# EAGLE design SG1000 - SMS OD (EAGLE 9.6.2)
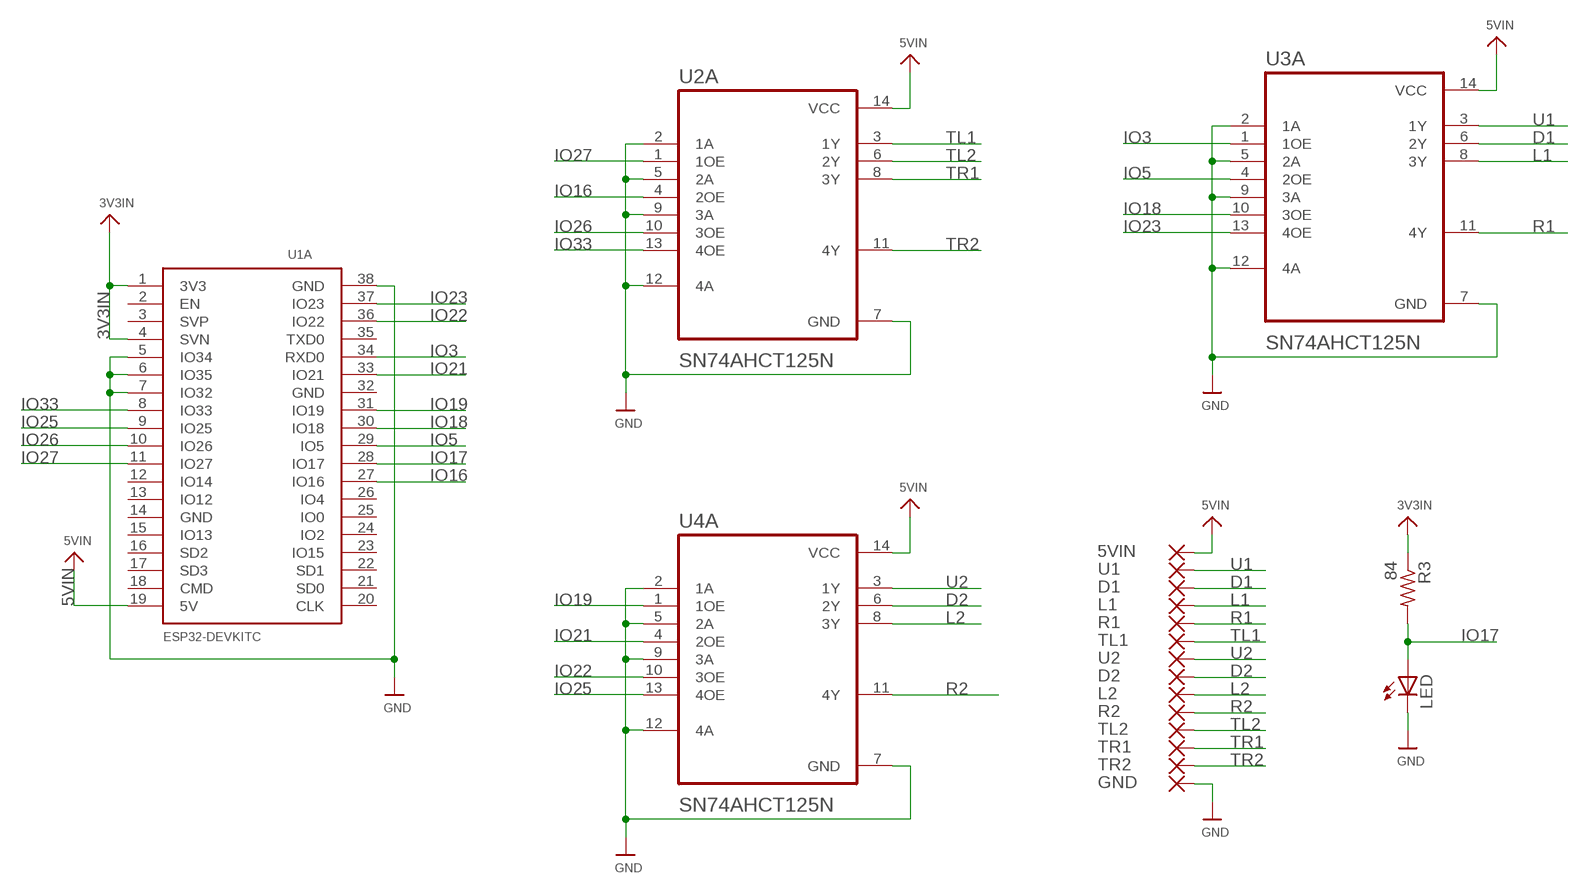
[diagram p0: schematic, sheet 1]

## Parts
5VIN  SMD5  [SMD2,54-5,08]
D1  SMD5  [SMD2,54-5,08]
D2  SMD5  [SMD2,54-5,08]
GND  SMD5  [SMD2,54-5,08]
L1  SMD5  [SMD2,54-5,08]
L2  SMD5  [SMD2,54-5,08]
LED  LEDCHIPLED_1206  [CHIPLED_1206]
R1  SMD5  [SMD2,54-5,08]
R2  SMD5  [SMD2,54-5,08]
R3  84  R-US_R1206  [R1206]
TL1  SMD5  [SMD2,54-5,08]
TL2  SMD5  [SMD2,54-5,08]
TR1  SMD5  [SMD2,54-5,08]
TR2  SMD5  [SMD2,54-5,08]
U1  SMD5  [SMD2,54-5,08]
U1A  ESP32DEVKITC  [ESP32-DEVKITC]
U2  SMD5  [SMD2,54-5,08]
U2A  SN74AHCT125N  [DIP794W45P254L1969H508Q14]
U3A  SN74AHCT125N  [DIP794W45P254L1969H508Q14]
U4A  SN74AHCT125N  [DIP794W45P254L1969H508Q14]

## Nets
3V3IN: R3.1 U1A.1(3V3) U1A.4(SVN)
5VIN: 5VIN.1(P) U1A.19(5V) U2A.14(VCC) U3A.14(VCC) U4A.14(VCC)
D1: D1.1(P) U3A.6(2Y)
D2: D2.1(P) U4A.6(2Y)
GND: GND.1(P) LED.C U1A.5(IO34) U1A.6(IO35) U1A.7(IO32) U1A.38(GND) U2A.2(1A) U2A.5(2A) U2A.7(GND) U2A.9(3A) U2A.12(4A) U3A.2(1A) U3A.5(2A) U3A.7(GND) U3A.9(3A) U3A.12(4A) U4A.2(1A) U4A.5(2A) U4A.7(GND) U4A.9(3A) U4A.12(4A)
IO3: U1A.34(RXD0) U3A.1(1OE)
IO5: U1A.29(IO5) U3A.4(2OE)
IO16: U1A.27(IO16) U2A.4(2OE)
IO17: LED.A R3.2 U1A.28(IO17)
IO18: U1A.30(IO18) U3A.10(3OE)
IO19: U1A.31(IO19) U4A.1(1OE)
IO21: U1A.33(IO21) U4A.4(2OE)
IO22: U1A.36(IO22) U4A.10(3OE)
IO23: U1A.37(IO23) U3A.13(4OE)
IO25: U1A.9(IO25) U4A.13(4OE)
IO26: U1A.10(IO26) U2A.10(3OE)
IO27: U1A.11(IO27) U2A.1(1OE)
IO33: U1A.8(IO33) U2A.13(4OE)
L1: L1.1(P) U3A.8(3Y)
L2: L2.1(P) U4A.8(3Y)
R1: R1.1(P) U3A.11(4Y)
R2: R2.1(P) U4A.11(4Y)
TL1: TL1.1(P) U2A.3(1Y)
TL2: TL2.1(P) U2A.6(2Y)
TR1: TR1.1(P) U2A.8(3Y)
TR2: TR2.1(P) U2A.11(4Y)
U1: U1.1(P) U3A.3(1Y)
U2: U2.1(P) U4A.3(1Y)
Unconnected: U1A.2(EN) U1A.3(SVP) U1A.12(IO14) U1A.13(IO12) U1A.14(GND) U1A.15(IO13) U1A.16(SD2) U1A.17(SD3) U1A.18(CMD) U1A.20(CLK) U1A.21(SD0) U1A.22(SD1) U1A.23(IO15) U1A.24(IO2) U1A.25(IO0) U1A.26(IO4) U1A.32(GND) U1A.35(TXD0)

## Library data of the parts
5VIN D1 D2 GND L1 L2 R1 R2 TL1 TL2 TR1 TR2 U1 U2 = wirepad:SMD5: SMD PAD
LED = adafruit:LED: LED OSRAM: - CHIPLED LG R971, LG N971, LY N971, LG Q971, LY Q971, LO R971, LY R971 LH N974, LH R974 LS Q976, LO Q976, LY Q976 LO Q996 - Hyper CHIPLED LW Q18S LB Q993, LB Q99A, LB R99A - SideLED LS A670, LO A670, LY A670, LG A670, LP A670 LB A673, LV A673, LT A673, LW A673 LH A674 LY A675 LS A676, LA A676, LO A676, LY A676, LW A676 LS A679, LY A679, LG A679 - Hyper Micro SIDELED® LS Y876, LA Y876, LO Y876, LY Y876 LT Y87S - SmartLED LW L88C, LW L88S LB L89C, LB L89S, LG L890 LS L89K, LO L89K, LY L89K LS L896, LA L896, LO L896, LY L896 - TOPLED LS T670, LO T670, LY T670, LG T670, LP T670 LSG T670, LSP T670, LSY T670, LOP T670, LYG T670 LG T671, LOG T671, LSG T671 LB T673, LV T673, LT T673, LW T673 LH T674 LS T676, LA T676, LO T676, LY T676, LB T676, LH T676, LSB T676, LW T676 LB T67C, LV T67C, LT T67C, LS T67K, LO T67K, LY T67K, LW E67C LS E67B, LA E67B, LO E67B, LY E67B, LB E67C, LV E67C, LT E67C LW T67C LS T679, LY T679, LG T679 LS T770, LO T770, LY T770, LG T770, LP T770 LB T773, LV T773, LT T773, LW T773 LH T774 LS E675, LA E675, LY E675, LS T675 LS T776, LA T776, LO T776, LY T776, LB T776 LHGB T686 LT T68C, LB T68C - Hyper Mini TOPLED® LB M676 - Mini TOPLED Santana® LG M470 LS M47K, LO M47K, LY M47K Source: http://www.osram.convergy.de/
R3 = adafruit:R-US_: RESISTOR, American symbol
U1A = ESP32-DEVKITC:ESP32DEVKITC
U2A U3A U4A = SN74AHCT125N:SN74AHCT125N: None Check prices <https://pricing.snapeda.com/parts/SN74AHCT125N/Texas%20Instruments/view-part?ref=eda>; AVAILABILITY: In Stock; DESCRIPTION: Quadruple Bus Buffer Gates With 3-State Outputs 14-PDIP -40 to 125; MF: Texas Instruments; MP: SN74AHCT125N; PACKAGE: PDIP-14 Texas Instruments; PRICE: None; PURCHASE-URL: https://pricing.snapeda.com/search/part/SN74AHCT125N/?ref=eda

## Board
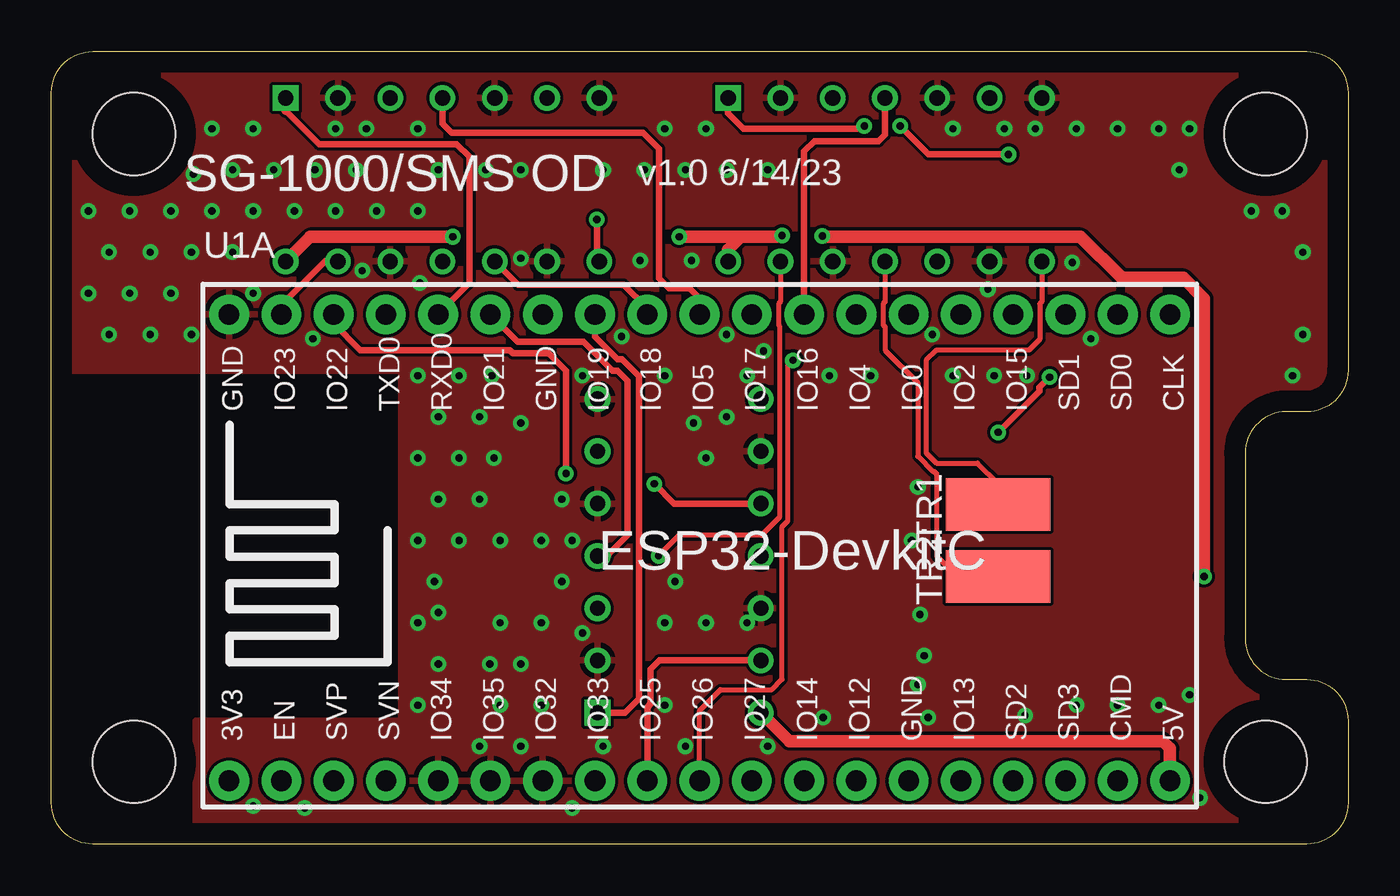
[diagram p1: board, top side]
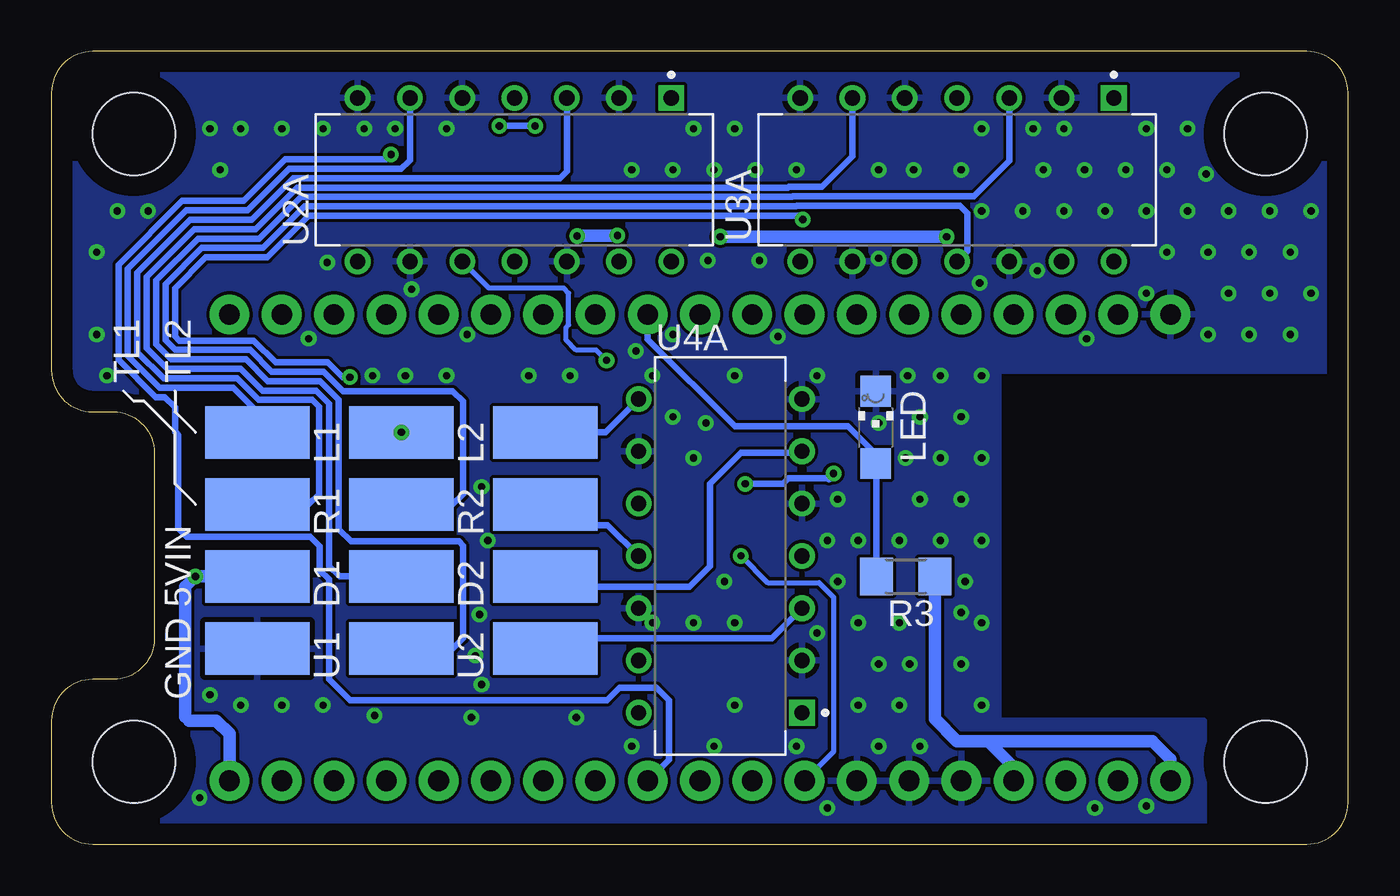
[diagram p2: board, bottom side, seen from below]

Size 63 x 38.5 mm. Coordinates in mm from the lower left corner, seen from the top.
Outline: 0,2 0,36.5 arc-90 2,38.5 61,38.5 arc-90 63,36.5 63,23 arc-90 61,21 60,21 arc90 58,19 58,10 arc90 60,8 61,8 arc-90 63,6 63,2 arc-90 61,0 2,0 arc-90 0,2
Copper layers (1*16): Top 0.035mm / dielectric 1.5mm / Bottom 0.035mm
Design rules "default": minimum track width 6mil, minimum drill 0.35mm, track to track 6mil, track to pad 6mil, pad to pad 6mil, via to via 6mil, smd to smd 6mil, copper to edge 40mil, drill to drill 6mil, minimum pad ring 10mil, minimum via ring 8mil, stop-mask expansion 4mil, vias tented up to drill 0.5mm, thermal gap 10mil
Holes 4 mm at 4,4 4,34.5 59,34.5 59,4

### Footprints (pad centres in the part's own frame; a part is rotated, then mirrored left to right if it is on the bottom)
SMD2,54-5,08 = smd 2.54 x 5.08: 1 0,0
CHIPLED_1206 = smd 1.5 x 1.5: A 0,-1.75; C 0,1.75
R1206 = smd 1.6 x 1.803: 1 -1.422,0; 2 1.422,0
ESP32-DEVKITC = drill 1 pad 1.93: 1 -22.87,-11.42; 2 -20.33,-11.42; 3 -17.79,-11.42; 4 -15.25,-11.42; 5 -12.71,-11.42; 6 -10.17,-11.42; 7 -7.63,-11.42; 8 -5.09,-11.42; 9 -2.55,-11.42; 10 -0.01,-11.42; 11 2.53,-11.42; 12 5.07,-11.42; 13 7.61,-11.42; 14 10.15,-11.42; 15 12.69,-11.42; 16 15.23,-11.42; 17 17.77,-11.42; 18 20.31,-11.42; 19 22.85,-11.42; 20 22.85,11.23; 21 20.31,11.23; 22 17.77,11.23; 23 15.23,11.23; 24 12.69,11.23; 25 10.15,11.23; 26 7.61,11.23; 27 5.07,11.23; 28 2.53,11.23; 29 -0.01,11.23; 30 -2.55,11.23; 31 -5.09,11.23; 32 -7.63,11.23; 33 -10.17,11.23; 34 -12.71,11.23; 35 -15.25,11.23; 36 -17.79,11.23; 37 -20.33,11.23; 38 -22.87,11.23
DIP794W45P254L1969H508Q14 = drill 0.74 pad 1.14 square: 1 -3.97,7.62 | drill 0.74 pad 1.14: 2 -3.97,5.08; 3 -3.97,2.54; 4 -3.97,0; 5 -3.97,-2.54; 6 -3.97,-5.08; 7 -3.97,-7.62; 8 3.97,-7.62; 9 3.97,-5.08; 10 3.97,-2.54; 11 3.97,0; 12 3.97,2.54; 13 3.97,5.08; 14 3.97,7.62

### Placement (x,y rotation side)
5VIN  53,13 270 bottom
D1  46,13 270 bottom
D2  39,13 270 bottom
GND  53,9.5 270 bottom
L1  46,20 270 bottom
L2  39,20 270 bottom
LED  22.95,20.24 0 bottom
R1  46,16.5 270 bottom
R2  39,16.5 270 bottom
R3  21.5,13 180 bottom
TL1  53,16.5 270 bottom
TL2  53,20 90 bottom
TR1  46,16.5 90 top
TR2  46,13 90 top
U1  46,9.5 270 bottom
U1A  31.5,14.5 0 top
U2  39,9.5 270 bottom
U2A  40.5,32.27 270 bottom
U3A  19,32.27 270 bottom
U4A  30.5,14 180 bottom

### Tracks (layer width: path | path; a pad name or v marks a point on that pad's centre or on a via)
3V3IN
  Bottom 0.61: U1A.1 8.63,4.13 9.5,5 17.5,5 | R3.1 20.08,6.08 19,5 17.5,5 | U1A.4 16.25,3.75 17.5,5
5VIN  (via drill 0.35)
  Top 0.61: U1A.19 54.35,4.65 54,5 35.85,5 U4A.14 | v37.46,29.54 37.5,29.5 50,29.5 52,27.5 55,27.5 56,26.5 v56,13 | v35.5,29.57 35.43,29.5 33.5,29.5 | 33.5,29.5 32.88,28.88 U2A.14 | 33.5,29.5 v30.5,29.5 | v19.5,29.5 12.58,29.5 U3A.14
  Bottom 0.61: U1A.19 54.35,5.35 55,6 56.3,6 56.5,6.2 56.5,12.5 v56,13 5VIN.1 | v37.46,29.54 35.52,29.54 v35.5,29.57 | v30.5,29.5 v19.5,29.5
D1
  Bottom 0.305: U3A.6 24.08,33.42 25.57,31.93 27.16,31.93 27.2,31.89 51.07,31.89 53.09,29.87 56.07,29.87 58.37,27.57 58.37,24.09 57.37,23.09 53.8,23.09 52.74,22.03 50.14,22.03 49.5,21.39 49.5,13.5 49,13 D1.1
D2
  Bottom 0.305: 26.61,19 29.5,19 31,17.5 31,13.5 32,12.5 38.5,12.5
  Bottom 0.406: U4A.6 26.61,19 | 38.5,12.5 D2.1
GND  (via drill 0.35)
  other vias: 2.8,24.75 1.8,26.75 2.8,28.75 1.8,30.75 4.8,24.75 3.8,26.75 4.8,28.75 3.8,30.75 6.8,24.75 5.8,26.75 6.8,28.75 5.8,30.75 6.9,32.55 12.3,1.75 8.8,28.75 7.8,30.75 8.8,32.75 7.8,34.75 9.8,1.85 9.8,26.75 9.8,30.75 10.8,32.75 9.8,34.75 18.8,11.25 12.7,24.55 11.8,30.75 12.8,32.75 15.1,27.85 13.8,30.75 14.8,32.75 13.8,34.75 15.8,30.75 15.3,34.75 17.8,6.75 18.8,8.75 17.8,10.75 18.6,12.75 17.8,14.75 18.8,16.75 17.8,18.75 18.8,20.75 17.8,22.75 17.9,27.25 17.8,30.75 18.8,32.75 17.8,34.75 20.8,4.75 21.3,8.75 19.8,14.75 20.8,16.75 19.8,18.75 20.8,20.75 19.8,22.75 21.1,32.75 22.8,4.75 21.8,6.75 22.8,8.75 21.8,10.75 21.8,14.75 21.5,18.75 22.8,20.45 21.4,22.75 22.8,28.45 22.8,32.75 25.3,1.75 23.8,6.75 23.8,10.75 24.8,12.75 23.8,14.75 24.8,16.75 27.7,24.65 26.8,4.75 25.8,10.25 25.3,14.75 25.8,22.75 26.8,32.75 28.6,28.35 28.8,32.75 30.8,4.75 29.8,6.75 29.8,10.75 30.3,12.75 31.2,20.45 29.8,22.75 31.1,28.35 30.8,32.75 29.8,34.75 31.8,10.75 31.8,18.75 32.8,20.75 32.8,24.75 32.8,32.75 31.8,34.75 34.8,4.75 33.8,10.75 33.8,22.75 34.6,23.95 34.8,32.75 37.5,6.15 42.1,7.75 37.8,22.75 42.1,17.35 39.8,22.75 42.4,9.15 42.2,11.15 41.8,14.75 42.8,24.75 43.8,22.75 43.8,34.75 45.8,22.75 45.5,26.95 49.6,28.25 46.3,34.75 47.3,6.25 47.4,22.75 47.8,34.75 49.8,6.75 50.5,24.55 49.8,34.75 51.8,6.75 42.6,6.15 51.8,34.75 53.8,6.75 54.8,32.75 53.8,34.75 55.8,2.25 55.3,7.25 55.3,34.75 58.3,30.75 60.3,22.75 60.8,24.75 60.8,28.75 59.8,30.75
  pour Bottom: 7,0 63,0 63,38.5 0,38.5 0,23 17,23 17,6 7,6
  pour Top: 0,38.5 0,23 17,23 17,6 7,6 7,0 63,0 63,38.5
IO3
  Top 0.305: U1A.34 20.32,27.26 20.32,33.38 19.7,34 13,34 11.38,35.62
  Top 0.406: U3A.1 11.38,35.62
IO5
  Top 0.305: U3A.4 19,35 19.44,34.56 28.73,34.56 29.51,33.78 29.51,27.49 30,27 31,27 31.49,26.51 U1A.29
IO16
  Top 0.305: U2A.4 40.5,34.46 40.19,34.15 37.07,34.15 36.57,33.65 U1A.27
IO17
  Bottom 0.305: U1A.28 34.03,24.53 29.8,20.3 24.3,20.3 22.97,18.97 22.97,18.59 LED.A 22.92,18.46 R3.2
IO18
  Top 0.305: U1A.30 28.95,26.04 27.81,27.18 22.66,27.18 U3A.10
IO19
  Top 0.305: U4A.1 27.88,6.38 28.56,7.06 28.56,22.73 27.73,23.56 27.5,23.56 26.41,24.65 U1A.31
IO21
  Top 0.305: 27,14 28,15 28,22.5 27.5,23 27.27,23 25.86,24.41 22.65,24.41 U1A.33
  Top 0.406: U4A.4 27,14
IO22  (via drill 0.35)
  Top 0.305: U4A.10 30.25,16.54 v29.29,17.5 | U1A.36 13.71,25.29 15,24 22.27,24 22.42,23.85 24.15,23.85 25,23 v25,18
  Bottom 0.305: v29.29,17.5 27.46,17.5 27.18,17.78 25.22,17.78
  Bottom 0.406: 25.22,17.78 v25,18
IO23
  Top 0.305: U3A.13 13.3,28.3 11.17,26.17 U1A.37
IO25
  Top 0.305: U4A.13 29.54,8.92 29.12,8.5 29.12,6.83 28.95,6.66 U1A.9
IO26  (via drill 0.35)
  Top 0.254: U1A.10 31.49,6.49 32.5,7.5 35,7.5 35.5,8 35.5,15.43 35.78,15.71 35.78,23.25 v36.03,23.5
  Bottom 0.254: v36.03,23.5 36.53,24 37,24 37.5,24 38,24.5 38,25.08 37.87,25.21 37.87,26.77 38.1,27 41.74,27 U2A.10
IO27  (via drill 0.35)
  Top 0.305: U2A.1 32.88,35.49 33.62,34.75 39.37,34.75 v39.5,34.88 | v41.23,34.88 42.62,33.5 v46.5,33.5
  Bottom 0.305: v41.23,34.88 v39.5,34.88 | v46.5,33.5 46.74,33.26 51.64,33.26 53.65,31.24 56.64,31.24 59.74,28.14 59.74,23.52 57.94,21.72 57.5,21.72 57,21.22 57,20.02 56.83,19.85 56.83,15.33 56.42,14.93 50.42,14.93 49.96,14.46 49.96,13.31 49.5,12.85 49.5,8 48.5,7 36,7 35.4,7.6 33.6,7.6 33,7 33,4.11 U1A.11
IO33  (via drill 0.35)
  Top 0.254: U2A.13 35.42,26.34 35.33,26.25 35.33,25.21 35.37,25.17 35.37,15.87 34.5,15 30.5,15 v29.5,14
  Bottom 0.254: v29.5,14 28.2,12.7 25.7,12.7 25,12 25,4.49 U1A.8
L1  (via drill 0.35)
  Top 0.305: U3A.8 26.5,28.42 v26.5,30.34 | v48.5,22.68 48,22.18 48,22 L1.1
  Bottom 0.305: v26.5,30.34 26.56,30.34 26.75,30.52 50.5,30.52 52.52,28.5 55.5,28.5 57,27 57,24.66 56.8,24.46 53.17,24.46 52.11,23.4 49.58,23.4 48.86,22.68 v48.5,22.68
  other vias: 46,20
L2
  Bottom 0.305: U4A.8 36.09,20 L2.1
R1
  Bottom 0.305: U3A.11 18.5,28.8 18.5,30.65 18.86,31.02 26.78,31.02 26.83,30.98 50.69,30.98 52.71,28.96 55.69,28.96 57.46,27.19 57.46,24.47 56.99,24 54.5,24 54.2,24 53.36,24 52.3,22.95 49.77,22.95 48.82,22 43.5,22 43,21.5 43,17 43.5,16.5 R1.1
R2
  Bottom 0.305: U4A.11 35.97,15.5 38,15.5
  Bottom 0.406: 38,15.5 R2.1
TL1
  Bottom 0.305: TL1.1 50.5,16.5 50,17 50,21.24 50.33,21.57 52.93,21.57 53.98,22.63 57.56,22.63 58.83,23.9 58.83,27.76 56.26,30.33 53.27,30.33 51.26,32.35 38.3,32.35 37.96,32.69 U2A.3
TL2
  Bottom 0.305: TL2.1 53,21 54.17,22.17 57.75,22.17 59.29,23.71 59.29,27.95 56.45,30.79 53.46,30.79 51.45,32.8 46,32.8 45.65,33.15 45.58,33.22 U2A.6
TR1
  Top 0.254: U2A.8 48.12,26.34 48.02,26.25 48.02,24.52 47.5,24 43,24 42.5,23.5 42.5,19 43,18.5 45,18.5 46,17.5 TR1.1
TR2
  Top 0.254: U2A.11 40.5,26.34 40.41,26.25 40.41,25.21 40.5,25.12 40.5,24 42.09,22.41 42.09,18.83 42.83,18.09 42.91,18.09 43,18 43,14 44,13 TR2.1
U1
  Bottom 0.305: U3A.3 16.46,33.19 18.18,31.48 26.97,31.48 27.02,31.43 50.88,31.43 52.9,29.41 55.88,29.41 57.91,27.38 57.91,24.28 57.18,23.55 53.55,23.55 52.49,22.49 49.95,22.49 49.04,21.58 49.04,15.3 48.44,14.7 43.2,14.7 43,14.5 43,10 43.5,9.5 U1.1
U2
  Bottom 0.305: U4A.3 27.99,10 38.5,10
  Bottom 0.406: 38.5,10 U2.1

### Text on the board
tPlace: SG-1000/SMS OD | v1.0 6/14/23